# EAGLE design max-lader-1.3 (EAGLE 7.7.0)
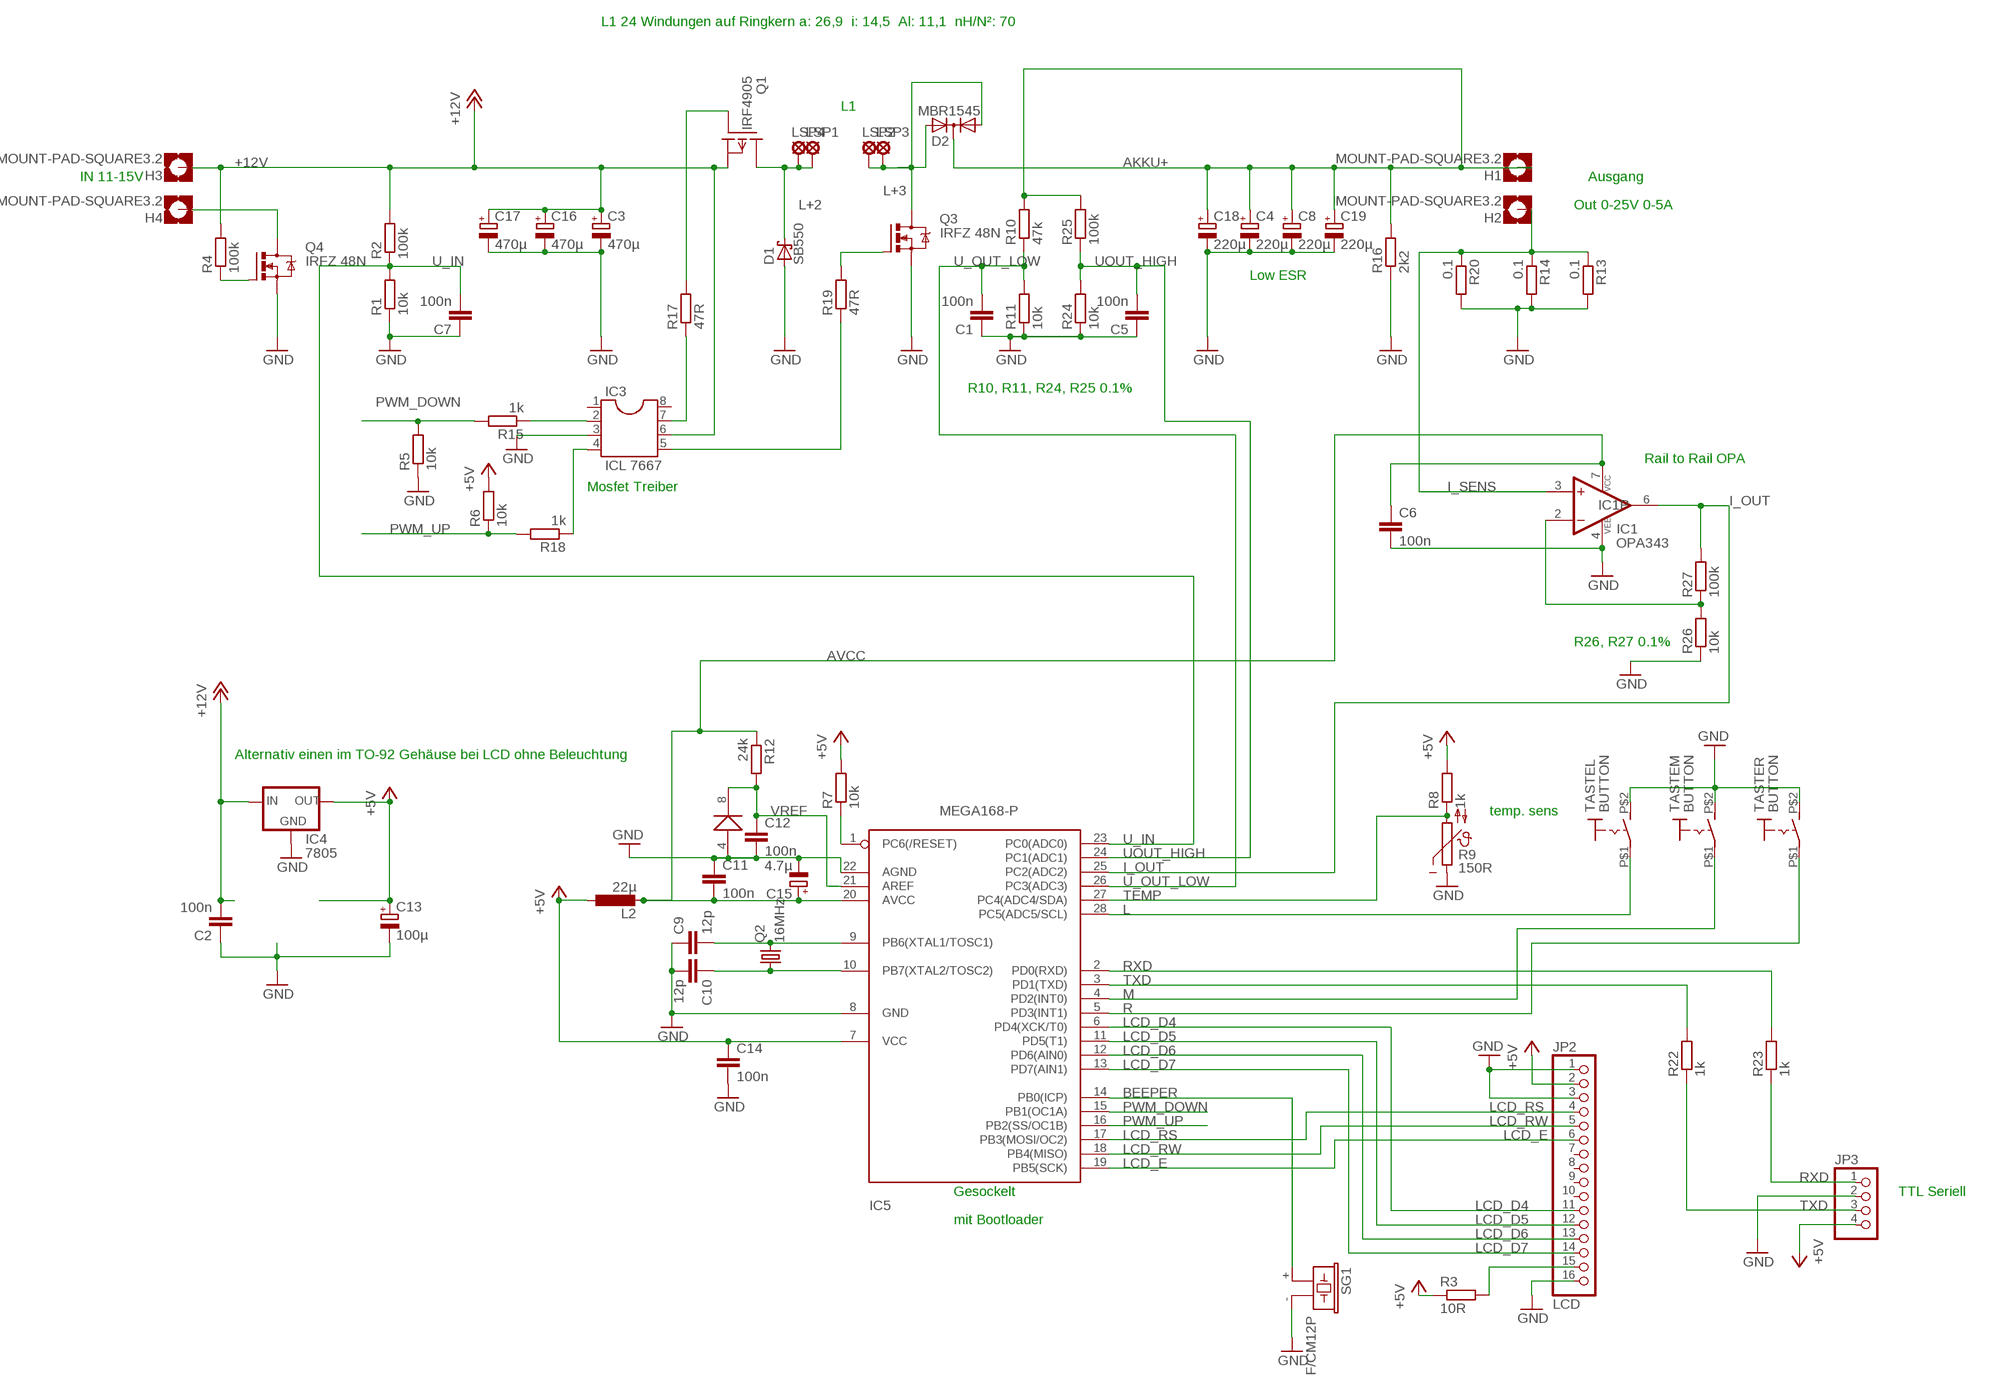
[diagram p0: schematic, sheet 1]

## Parts
C1  100n  C-EU050-024X044  [C050-024X044]
C2  100n  C-EU050-025X075  [C050-025X075]
C3  470µ  CPOL-EUE3.5-8  [E3,5-8]
C4  220µ  CPOL-EUE3.5-8  [E3,5-8]
C5  100n  C-EU050-024X044  [C050-024X044]
C6  100n  C-EU050-024X044  [C050-024X044]
C7  100n  C-EU050-025X075  [C050-025X075]
C8  220µ  CPOL-EUE3.5-8  [E3,5-8]
C9  12p  C-EU050-024X044  [C050-024X044]
C10  12p  C-EU050-024X044  [C050-024X044]
C11  100n  C-EU050-025X075  [C050-025X075]
C12  100n  C-EU050-024X044  [C050-024X044]
C13  100µ  CPOL-EUE3.5-8  [E3,5-8]
C14  100n  C-EU050-024X044  [C050-024X044]
C15  4.7µ  CPOL-EUE2-4  [E2-4]
C16  470µ  CPOL-EUE3.5-8  [E3,5-8]
C17  470µ  CPOL-EUE3.5-8  [E3,5-8]
C18  220µ  CPOL-EUE3.5-8  [E3,5-8]
C19  220µ  CPOL-EUE3.5-8  [E3,5-8]
D1  SB550  SCHOTTKY-DIODEDO201T15  [DO201T15]
D2  MBR1545  FEP16AT  [TO220ABS]
H1  MOUNT-PAD-SQUARE3.2  [3,2-PAD-SQUARE]
H2  MOUNT-PAD-SQUARE3.2  [3,2-PAD-SQUARE]
H3  MOUNT-PAD-SQUARE3.2  [3,2-PAD-SQUARE]
H4  MOUNT-PAD-SQUARE3.2  [3,2-PAD-SQUARE]
IC1  OPA343  MAX4105ESA  [SO08]
IC2  LM385-2.5  LM385  [SO08]
IC3  ICL 7667  DIL8  [DIL08]
IC4  7805  78XXL  [78XXL]
IC5  MEGA168-P  MEGA8-P  [DIL28-3]
JP2  LCD  PINHD-1X16  [1X16]
JP3  PINHD-1X4  [1X04]
L2  22µ  L-EU0207/12  [0207/12]
LSP1  SE13  [SE13]
LSP2  SE13  [SE13]
LSP3  SE13  [SE13]
LSP4  SE13  [SE13]
Q1  IRF4905  IRF9530V  [TO220V]
Q2  16MHz  CRYTALHC49S  [HC49/S]
Q3  IRFZ 48N  IRF740  [TO220BV]
Q4  IRFZ 48N  IRF740  [TO220BV]
R1  10k  R-EU_0207/10  [0207/10]
R2  100k  R-EU_0207/10  [0207/10]
R3  10R  R-EU_0207/10  [0207/10]
R4  100k  R-EU_0204/7  [0204/7]
R5  10k  R-EU_R0805  [R0805]
R6  10k  R-EU_R0805  [R0805]
R7  10k  R-EU_R0805  [R0805]
R8  1k  R-EU_R0805  [R0805]
R9  150R  NTC642-6  [P642]
R10  47k  R-EU_0207/10  [0207/10]
R11  10k  R-EU_0207/10  [0207/10]
R12  24k  R-EU_0207/10  [0207/10]
R13  0.1  R-EU_0613/15  [P0613/15]
R14  0.1  R-EU_0613/15  [P0613/15]
R15  1k  R-EU_R0805  [R0805]
R16  2k2  R-EU_0207/2V  [0207/2V]
R17  47R  R-EU_0207/10  [0207/10]
R18  1k  R-EU_R0805  [R0805]
R19  47R  R-EU_0207/10  [0207/10]
R20  0.1  R-EU_0613/15  [P0613/15]
R22  1k  R-EU_R0805  [R0805]
R23  1k  R-EU_R0805  [R0805]
R24  10k  R-EU_0207/10  [0207/10]
R25  100k  R-EU_0207/10  [0207/10]
R26  10k  R-EU_0207/10  [0207/10]
R27  100k  R-EU_0207/10  [0207/10]
SG1  F/CM12P  [F/CM12P]
TASTEL  BUTTON  [BUT]
TASTEM  BUTTON  [BUT]
TASTER  BUTTON  [BUT]

## Nets
+5V: C13.+ C14.1 IC4.OUT IC5.7(VCC) JP2.2 JP3.4 L2.1 R3.1 R6.2 R7.2 R8.2
+12V: C2.2 C3.+ C16.+ C17.+ H3.B3,2(MOUNT) IC3.6 IC4.IN Q1.3(S) R2.2 R4.2
AKKU+: C4.+ C8.+ C18.+ C19.+ D2.C H1.B3,2(MOUNT) R10.2 R16.2 R25.2
AVCC: C6.1 C11.2 C15.+ IC1.7(VCC) IC5.20(AVCC) L2.2 R12.1
BAT-: H4.B3,2(MOUNT) Q4.D
BEEPER: IC5.14(PB0(ICP)) SG1.+
BOOST_CTRL: IC3.5 R19.1
BOOST_GATE: Q3.G R19.2
BUCK_CTRL: IC3.7 R17.1
BUCK_GATE: Q1.1(G) R17.2
GND: C1.1 C2.1 C3.- C4.- C5.1 C6.2 C7.1 C8.- C9.1 C10.2 C11.1 C12.2 C13.- C14.2 C15.- C16.- C17.- C18.- C19.- D1.A IC1.4(VEE) IC2.4(ANODE) IC3.3 IC4.GND IC5.8(GND) IC5.22(AGND) JP2.1 JP2.3 JP2.16 JP3.2 Q3.S Q4.S R1.1 R5.1 R9.1 R11.1 R13.2 R14.2 R16.1 R20.2 R24.1 R26.1 SG1.- TASTEL.P$2(S) TASTEM.P$2(S) TASTER.P$2(S)
I_OUT: IC1.6(OUT) IC5.25(PC2(ADC2)) R27.2
I_SENS: H2.B3,2(MOUNT) IC1.3(+IN) R13.1 R14.1 R20.1
INPUT_GATE: Q4.G R4.1
L: IC5.28(PC5(ADC5/SCL)) TASTEL.P$1(P)
L+2: D1.C LSP1.MP LSP4.MP Q1.2(D)
L+3: D2.A1 D2.A2 LSP2.MP LSP3.MP Q3.D
LCD_D4: IC5.6(PD4(XCK/T0)) JP2.11
LCD_D5: IC5.11(PD5(T1)) JP2.12
LCD_D6: IC5.12(PD6(AIN0)) JP2.13
LCD_D7: IC5.13(PD7(AIN1)) JP2.14
LCD_E: IC5.19(PB5(SCK)) JP2.6
LCD_RS: IC5.17(PB3(MOSI/OC2)) JP2.4
LCD_RW: IC5.18(PB4(MISO)) JP2.5
M: IC5.4(PD2(INT0)) TASTEM.P$1(P)
N$1: IC3.4 R18.1
N$2: IC5.1(PC6(/RESET)) R7.1
N$3: IC3.2 R15.1
N$5: C9.2 IC5.9(PB6(XTAL1/TOSC1)) Q2.2
N$6: C10.1 IC5.10(PB7(XTAL2/TOSC2)) Q2.1
N$8: JP2.15 R3.2
N$9: IC1.2(-IN) R26.2 R27.1
PWM_DOWN: IC5.15(PB1(OC1A)) R5.2 R15.2
PWM_UP: IC5.16(PB2(SS/OC1B)) R6.1 R18.2
R: IC5.5(PD3(INT1)) TASTER.P$1(P)
RXD: IC5.2(PD0(RXD)) R23.2
RXD_OUT: JP3.1 R23.1
TEMP: IC5.27(PC4(ADC4/SDA)) R8.1 R9.2
TXD: IC5.3(PD1(TXD)) R22.2
TXD_OUT: JP3.3 R22.1
U_IN: C7.2 IC5.23(PC0(ADC0)) R1.2 R2.1
U_OUT_LOW: C1.2 IC5.26(PC3(ADC3)) R10.1 R11.2
UOUT_HIGH: C5.2 IC5.24(PC1(ADC1)) R24.2 R25.1
VREF: C12.1 IC2.8(CATODE) IC5.21(AREF) R12.2
Unconnected: IC1.1(NC) IC1.5(NC) IC1.8(NC) IC3.1 IC3.8 JP2.7 JP2.8 JP2.9 JP2.10

## Notes on the sheet
- L1 24 Windungen auf Ringkern a: 26,9  i: 14,5  Al: 11,1  nH/N²: 70
- L1
- IN 11-15V | Ausgang
- Out 0-25V 0-5A
- Low ESR
- R10, R11, R24, R25 0.1%
- Rail to Rail OPA
- Mosfet Treiber
- R26, R27 0.1%
- Alternativ einen im TO-92 Gehäuse bei LCD ohne Beleuchtung
- temp. sens
- Gesockelt | TTL Seriell
- mit Bootloader

## Library data of the parts
C1 C2 C5-C7 C9-C12 C14 = rcl:C-EU: CAPACITOR, European symbol
C3 C4 C8 C13 C15-C19 = rcl:CPOL-EU: POLARIZED CAPACITOR, European symbol
D1 = diode:SCHOTTKY-DIODE: Schottky Diode
D2 = diode:FEP16AT: DIODE dual ultra-fast recovery rectifier, common cathode
H1-H4 = holes:MOUNT-PAD-SQUARE: MOUNTING PAD, square
IC1 = maxim:MAX4105ESA: OP AMP
IC2 = linear:LM385
IC3 = ic-package:DIL8: Dual In Line
IC4 = v-reg:78XXL: VOLTAGE REGULATOR
IC5 = avr2:MEGA8-P: MICROCONTROLLER 8 Kbytes FLASH 1 kbytes SRAM 512 bytes EEPROM USART 4-channel 10 bit ADC 2-channel 8 bit ADC
JP2 = pinhead:PINHD-1X16: PIN HEADER
JP3 = pinhead:PINHD-1X4: PIN HEADER
L2 = rcl:L-EU: INDUCTOR, European symbol
LSP1-LSP4 = solpad:SE13: SOLDER PAD E1542, drill 1,3mm, distributor Buerklin, 07F815
Q1 = transistor-fet:IRF9530: P-Channel Enhancement MOSFET (HEXFET); -100V; -12A; 0,3Ohm
Q2 = crystal:CRYTAL: CRYSTAL
Q3 Q4 = transistor-power:IRF740: N-CHANNEL MOS FET
R1-R8 R10-R20 R22-R27 = rcl:R-EU_: RESISTOR, European symbol
R9 = ptc-ntc:NTC642-6: PHILIPS NTC
SG1 = buzzer:F/CM12P: BUZZER Source: Buerklin
TASTEL TASTEM TASTER = switch:BUTTON

## Board
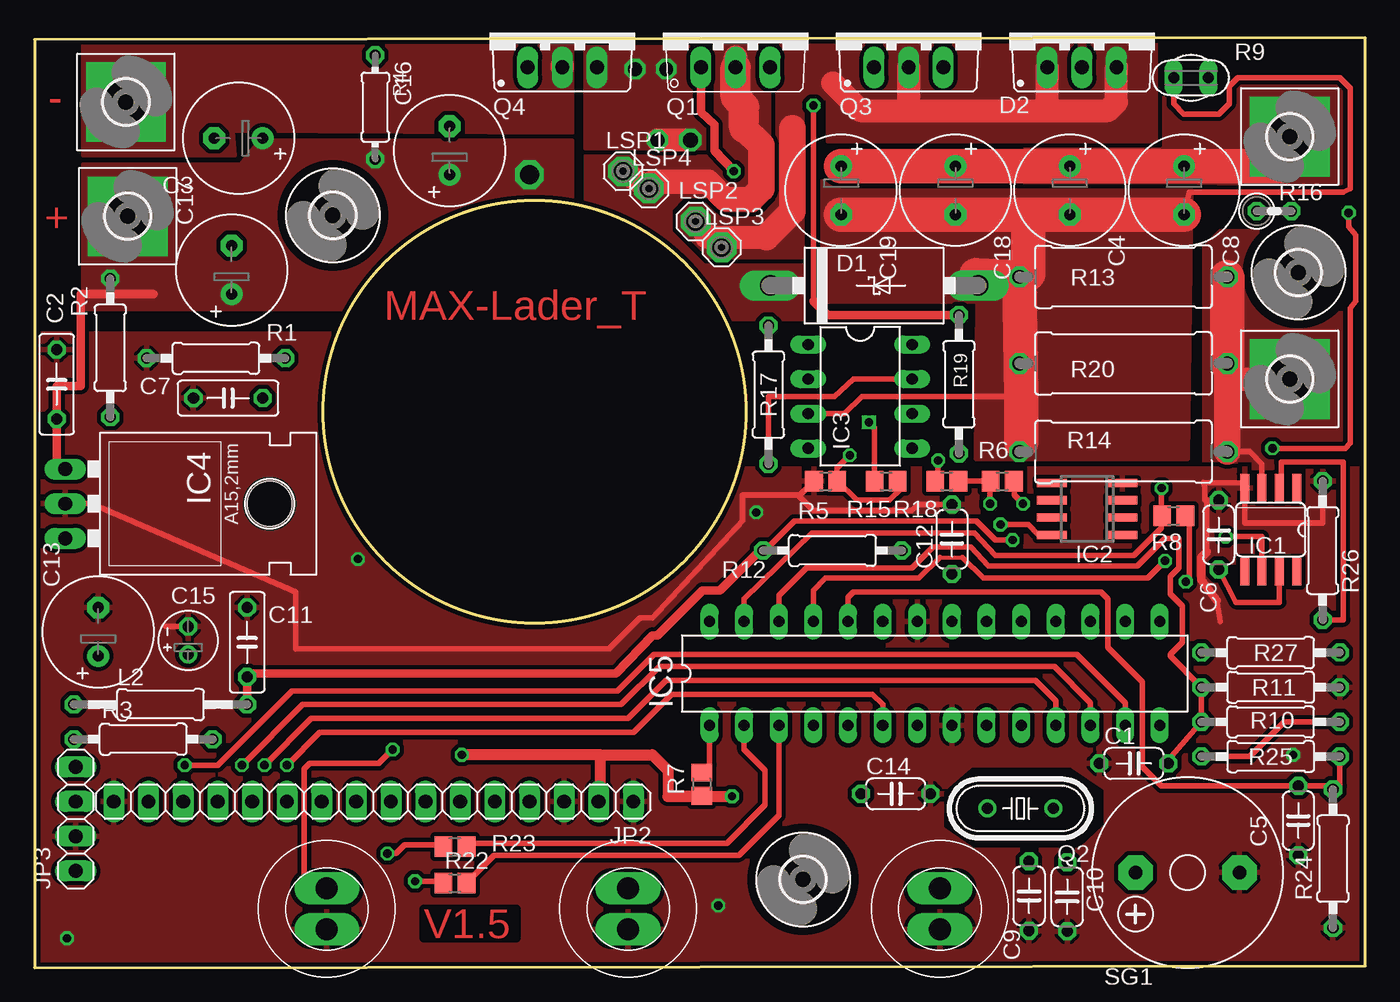
[diagram p1: board, top side]
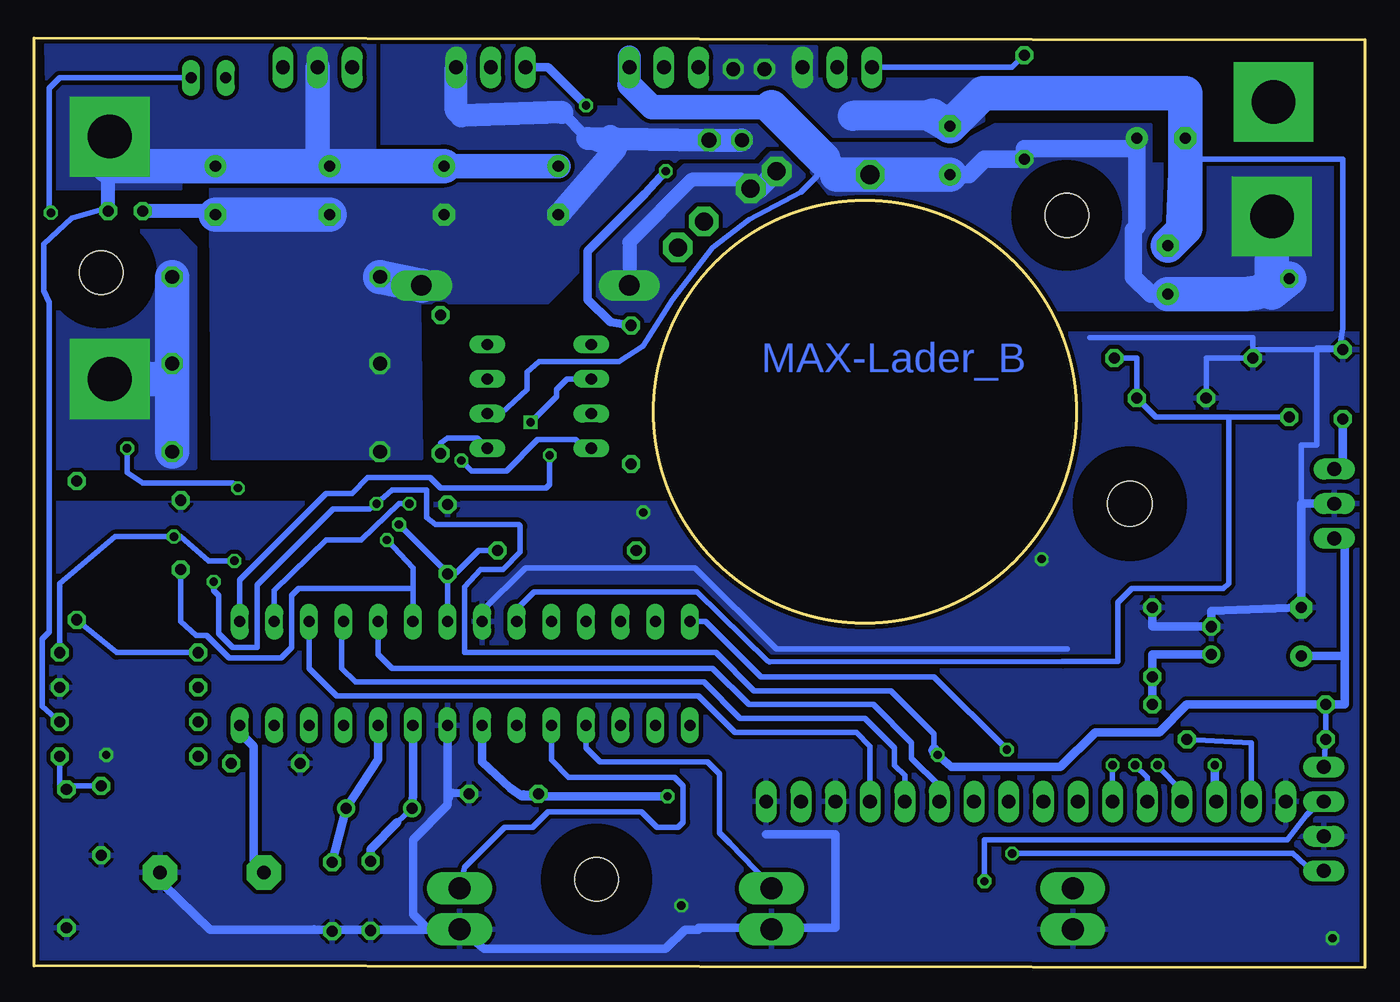
[diagram p2: board, bottom side, seen from below]

Size 97.59 x 68.19 mm. Coordinates in mm from the lower left corner, seen from the top.
Outline: 0,0 97.59,0.13 97.59,68.19 0,68.06 0,0
Outline: circle at 36.66,40.76 radius 15.5
Copper layers (1*16): Top 0.035mm / dielectric 1.5mm / Bottom 0.035mm
Design rules "default *": minimum track width 12mil, minimum drill 24mil, track to track 12mil, track to pad 12mil, pad to pad 12mil, via to via 12mil, smd to smd 8mil, copper to edge 12mil, drill to drill 12mil, minimum pad ring 10mil, minimum via ring 8mil, stop-mask expansion 4mil, vias tented up to drill 0mil, thermal gap 10mil
tRestrict: area 66.9,9 to 78.2,14.5

### Footprints (pad centres in the part's own frame; a part is rotated, then mirrored left to right if it is on the bottom)
C050-024X044 = drill 0.813 octagon: 1 -2.54,0; 2 2.54,0
C050-025X075 = drill 0.813 octagon: 1 -2.54,0; 2 2.54,0
E3,5-8 = drill 0.813 pad 1.6: + -1.778,0 | drill 0.813 pad 1.6 octagon: - 1.778,0
E2-4 = drill 0.813 pad 1.27: + -1.016,0 | drill 0.813 pad 1.27 octagon: - 1.016,0
DO201T15 = drill 1.499 long: A 7.62,0; C -7.62,0
TO220ABS = drill 1.016 long: A1 -2.54,-2.54; A2 2.54,-2.54; C 0,-2.54
3,2-PAD-SQUARE = drill 3.2 pad 5.842 square: B3,2 0,0
SO08 = smd 0.66 x 2.032: 1 -1.905,-3.073; 2 -0.635,-3.073; 3 0.635,-3.073; 4 1.905,-3.073; 5 1.905,3.073; 6 0.635,3.073; 7 -0.635,3.073; 8 -1.905,3.073
SO08' = smd 0.6 x 2.2: 1 -1.905,-2.6; 2 -0.635,-2.6; 3 0.635,-2.6; 4 1.905,-2.6; 5 1.905,2.6; 6 0.635,2.6; 7 -0.635,2.6; 8 -1.905,2.6
DIL08 = drill 0.813 long: 1 -3.81,-3.81; 2 -1.27,-3.81; 3 1.27,-3.81; 4 3.81,-3.81; 5 3.81,3.81; 6 1.27,3.81; 7 -1.27,3.81; 8 -3.81,3.81
78XXL = drill 1.016 long: GND 0,-3.81; IN -2.54,-3.81; OUT 2.54,-3.81 | hole 3.302: 0,11.176
DIL28-3 = drill 0.813 long: 1 -16.51,-3.81; 2 -13.97,-3.81; 3 -11.43,-3.81; 4 -8.89,-3.81; 5 -6.35,-3.81; 6 -3.81,-3.81; 7 -1.27,-3.81; 8 1.27,-3.81; 9 3.81,-3.81; 10 6.35,-3.81; 11 8.89,-3.81; 12 11.43,-3.81; 13 13.97,-3.81; 14 16.51,-3.81; 15 16.51,3.81; 16 13.97,3.81; 17 11.43,3.81; 18 8.89,3.81; 19 6.35,3.81; 20 3.81,3.81; 21 1.27,3.81; 22 -1.27,3.81; 23 -3.81,3.81; 24 -6.35,3.81; 25 -8.89,3.81; 26 -11.43,3.81; 27 -13.97,3.81; 28 -16.51,3.81
1X16 = drill 1.016 long: 1 -19.05,0; 2 -16.51,0; 3 -13.97,0; 4 -11.43,0; 5 -8.89,0; 6 -6.35,0; 7 -3.81,0; 8 -1.27,0; 9 1.27,0; 10 3.81,0; 11 6.35,0; 12 8.89,0; 13 11.43,0; 14 13.97,0; 15 16.51,0; 16 19.05,0
1X04 = drill 1.016 long: 1 -3.81,0; 2 -1.27,0; 3 1.27,0; 4 3.81,0
0207/12 = drill 0.813 octagon: 1 -6.35,0; 2 6.35,0
SE13 = drill 1.321 pad 2.159 octagon: MP 0,0
TO220V = drill 1.016 long: 1 -2.54,-2.54; 2 0,-2.54; 3 2.54,-2.54
HC49/S = drill 0.813: 1 -2.413,0; 2 2.413,0
TO220BV = drill 1.016 long: D 0,-2.54; G -2.54,-2.54; S 2.54,-2.54
0207/10 = drill 0.813 octagon: 1 -5.08,0; 2 5.08,0
0204/7 = drill 0.813 octagon: 1 -3.81,0; 2 3.81,0
R0805 = smd 1.3 x 1.5: 1 -0.85,0; 2 0.85,0
P642 = drill 0.813 long: 1 -1.27,0; 2 1.27,0
P0613/15 = drill 1.016 octagon: 1 -7.62,0; 2 7.62,0
0207/2V = drill 0.813 octagon: 1 -1.27,0; 2 1.27,0
F/CM12P = drill 1.016 pad 2.54 octagon: + 3.81,0; - -3.81,0
BUT = drill 1.6 long: P$1 0,1.5; P$2 0,-1.5
3,2 = hole 3.2: 0,0

### Placement (x,y rotation side)
C1  80.61,14.98 0 top
C2  1.61,42.79 270 top
C3  14.95,60.83 180 top
C4  75.91,57.02 270 top
C5  92.67,10.79 90 top
C6  86.83,31.74 90 top
C7  14.19,41.78 0 top
C8  84.29,57.02 270 top
C9  72.92,5.27 90 top
C10  75.72,5.2 270 top
C11  15.58,23.87 270 top
C12  67.27,31.43 90 top
C13  4.66,24.63 90 top
C14  63.14,12.76 0 top
C15  11.27,24 90 top
C16  30.44,59.94 90 top
C17  14.44,51.18 90 top
C18  67.53,57.02 270 top
C19  59.14,57.02 270 top
D1  61.56,50.03 0 top
D2  76.8,68.58 0 top
H1  92.04,60.95 0 top
H2  92.04,43.17 0 top
H3  6.82,55.11 0 top
H4  6.69,63.5 0 top
IC1  90.64,32.13 180 top
IC2  LM385-2.5  [SO08']  77.18,33.65 90 top
IC3  60.54,41.91 270 top
IC4  6.06,34.03 270 top
IC5  66,21.59 0 top
JP2  24.85,12.19 180 top
JP3  3.01,10.92 90 top
L2  9.23,19.3 0 top
LSP1  43.14,58.41 0 top
LSP2  48.48,54.73 0 top
LSP3  50.38,52.83 0 top
LSP4  45.05,57.14 0 top
Q1  51.4,68.58 0 top
Q2  72.29,11.68 180 top
Q3  64.1,68.58 0 top
Q4  38.7,68.58 0 top
R1  13.3,44.7 0 top
R2  5.55,45.46 90 top
R3  7.96,16.76 0 top
R4  24.98,63.11 270 top
R5  58,35.68 0 top
R6  70.95,35.68 0 top
R7  48.92,13.46 270 top
R8  83.53,33.14 0 top
R9  84.8,65.27 0 top
R10  90.64,18.03 0 top
R11  90.64,20.57 180 top
R12  58.51,30.6 0 top
R13  79.84,50.67 180 top
R14  79.84,37.84 180 top
R15  62.45,35.68 0 top
R16  90.89,55.49 0 top
R17  53.81,42.03 90 top
R18  66.89,35.68 0 top
R19  67.78,42.79 90 top
R20  79.84,44.32 180 top
R22  30.82,6.22 0 top
R23  30.82,8.88 0 top
R24  95.21,8 90 top
R25  90.64,15.49 180 top
R26  94.45,30.6 270 top
R27  90.64,23.11 0 top
SG1  84.54,6.98 180 top
TASTEL  21.42,4.31 0 top
TASTEM  43.52,4.31 0 top
TASTER  66.38,4.31 0 top
U$2  [3,2]  21.87,55.18 0 top
U$3  [3,2]  92.67,50.99 0 top
U$4  [3,2]  56.35,6.47 0 top

### Tracks (layer width: path | path; a pad name or v marks a point on that pad's centre or on a via)
+5V  (via drill 0.6, 0.61)
  Top 0.406: R6.2 71.72,35.59 71.84,35.43 71.84,34.67 v72.48,34.03 | v84.42,28.32 84.67,28.7 84.67,32.89 84.38,33.18 R8.2
  Top 0.813: JP2.2 41.49,12.31 41.49,15.62 | 41.49,15.62 45.3,15.62 46.44,14.47 46.44,12.57 47.46,12.57 | 47.46,12.57 v51.14,12.57 | 41.49,15.62 v31.33,15.62 | 47.46,12.57 47.5,12.61 R7.2
  Bottom 0.406: C14.1 61.68,12.82 61.81,12.57 | v31.33,15.62 31.71,16 | 31.58,16 31.58,17.14 34.76,20.31 44.79,20.31 47.59,23.11 66,23.11 66,27.94 64.86,29.2 63.21,29.2 61.94,30.48 61.94,32.38 62.06,32.51 68.16,32.51 68.8,33.02 68.8,35.05 71.34,35.05 v72.48,34.03 72.99,33.65 75.65,33.65 81.24,28.06 81.24,23.49 83.02,23.49 84.04,24.51 84.04,27.3 84.42,27.68 v84.42,28.32 | L2.1 1.49,19.3 | L2.1 R3.1 JP3.4 | L2.1 2.88,19.43
  Bottom 0.61: IC5.7 64.73,15.11 62.7,13.2 61.81,12.57 v51.14,12.57 | v31.33,15.62 30.32,14.73 22.31,14.73 19.77,17.27 15.08,17.27 13.04,19.3 1.49,19.3 1.49,22.85 | 1.49,22.85 1.49,31.49 IC4.OUT | 1.49,22.85 C13.+
  Bottom 0.813: v31.33,15.62 31.58,15.87 31.58,16
+12V  (via drill 1.4)
  Top 0.406: IC4.IN 1.61,36.57
  Top 0.61: 8.72,49.4 3.39,49.4 3.39,42.67 1.61,42.67 1.61,36.57
  Bottom 0.406: 40.22,59.68 39.71,59.3 40.22,58.03 41.36,56.89 45.17,54.86 47.84,52.83 50.76,49.02 52.92,45.59 54.7,44.45 60.54,44.45 61.43,43.68 61.43,42.41 63.34,40.63 IC3.6 | IC4.IN 1.61,36.57
  Bottom 0.61: 1.61,36.57 C2.2
  Bottom 1.016: 7.96,49.52 7.96,49.65
  Bottom 1.27: C16.+ 29.04,58.16 27.9,59.3 R4.2 24.98,60.07 16.73,60.07 C3.+ 16.73,54.35 16.98,54.1 16.98,50.67 15.71,49.4 14.31,49.4
  Bottom 1.676: 53.94,64.77 Q1.3 53.94,66.8 | 38.7,58.16 39.71,59.3
  Bottom 1.778: 53.94,64.77 52.29,63.11 43.52,63.11
  Bottom 2.54: 39.71,59.3 43.52,63.11 | C16.+ v36.28,58.16 38.7,58.16 | 6.69,55.11 H3.B3,2 6.82,49.52 R2.2 7.96,49.52 8.72,49.4 14.31,49.4 C17.+
  pour Top (no thermals): 3.52,58.92 15.08,58.92 16.47,60.7 39.46,60.7 39.46,56.26 34,56.26 28.79,54.48 24.98,51.18 22.95,48.25 3.52,48.25
  pour Bottom (rank 2, no thermals): 2.37,48.25 23.08,48.25 24.35,50.54 27.52,53.84 32.22,55.75 39.33,56.76 42.25,60.45 29.68,60.45 27.14,61.84 15.71,61.84 15.71,58.92 2.37,58.92
AKKU+
  Top 0.406: R10.2 91.66,18.03 89.12,15.49 R25.2
  Top 2.54: C19.+ 91.4,58.8 92.16,60.19
  Bottom 0.406: 92.16,55.75 94.83,54.99 96.86,53.08 96.86,49.65 96.48,48.76 96.48,24.63 96.99,24.12 96.99,19.17 R10.2
  Bottom 1.016: 91.28,60.19 H1.B3,2 92.16,58.8 92.16,55.75 R16.2 | C4.+ 76.8,60.19
  Bottom 1.778: 76.8,60.19 D2.C | C18.+ C19.+
  Bottom 2.54: C18.+ C4.+ C8.+ 92.16,58.8 91.28,60.19
  pour Bottom (no thermals): 72.61,57.65 72.61,67.69 96.74,67.69 96.48,57.14 86.83,57.14 86.83,57.65
  pour Top (rank 3, no thermals): 72.61,57.53 72.61,67.69 96.74,67.69 96.48,57.14 86.83,57.14 86.83,57.53
AVCC  (via drill 0.6)
  Top 0.406: 53.56,30.6 55.72,32.76 69.05,32.76 70.45,31.36 v71.72,31.36 | IC1.7 91.28,26.79 88.1,26.79 C6.1 | 53.18,30.6 R12.1
  Top 0.61: L2.2 15.58,21.59 42.63,21.59 45.3,24.38 45.68,24.38 48.98,27.68 50.25,27.68 53.18,30.6 53.56,30.6
  Bottom 0.305: 69.81,27.11 69.87,27.8 69.88,27.94
  Bottom 0.406: IC5.20 69.81,27.11 69.81,29.33 v71.72,31.36 | 69.87,27.8 69.82,27.8 69.81,27.81 78.19,27.81 78.7,27.3 78.7,23.49 79.46,22.73 83.27,22.73 84.92,24.38 85.69,24.38 86.83,25.4 C6.1
  Bottom 0.61: C15.+ 15.58,22.98 C11.2 L2.2
BAT-
  Top 1.676: Q4.D 38.7,66.16
  pour Top (no thermals): 3.52,67.81 3.52,59.56 14.69,59.56 14.57,61.34 39.46,61.21 39.46,67.69
BEEPER
  Bottom 0.406: IC5.14 82.39,17.77
  Bottom 0.61: IC5.14 82.51,17.27 81.5,16.25 81.5,7.87 SG1.+
BOOST_CTRL
  Bottom 0.406: IC3.5 65.11,38.86 67.27,38.86 67.78,38.48 R19.1
BOOST_GATE  (via drill 0.6)
  Top 0.406: 57.11,48.89 v57.11,63.24
  Top 0.61: 57.11,48.89 58.13,47.87 R19.2
  Bottom 0.61: Q3.G 59.91,66.03 v57.11,63.24
BUCK_CTRL
  Top 0.406: R17.1 53.81,41.91 58.64,41.91 60.03,43.17 IC3.7
BUCK_GATE  (via drill 0.61)
  Top 0.61: v51.27,58.41 49.87,59.94 49.87,61.84 48.86,62.73 Q1.1
  Bottom 0.61: v51.27,58.41 52.79,56.76 56.98,52.57 56.98,49.02 55.33,47.37 R17.2
GND  (via drill 0.6, 1.02, 1.1)
  Top 0.406: 86.7,26.92 86.96,25.4 | C8.- 84.67,56.89 95.97,56.89 96.48,57.14 96.48,64.51 95.72,65.27 88.23,65.27 87.59,64.64 87.59,63.37 86.83,62.61 84.29,62.61 83.53,63.37 R9.1 83.66,65.4 | R26.1 94.45,32.63 88.73,32.63 IC1.4 88.73,35.55 85.69,35.58 85.81,35.3 85.81,34.28 85.94,34.28 | 85.94,30.48 85.94,34.28 | 67.27,33.9 C12.2 64.8,33.97 64.35,33.52 57.11,33.52 55.97,34.67 | 85.94,34.28 C6.2 | 80.73,35.55 IC2.4 | TASTEL.P$2 21.42,2.79 | IC3.3 59.4,40.63 60.67,41.91 72.35,41.91 | IC4.GND 4.15,34.03 19.14,27.55 19.14,23.36 42.13,23.36 44.41,25.65 45.3,25.65 51.91,32.76 51.91,34.67 55.97,34.67 | 9.61,25.01 C15.- | TASTEL.P$2 21.42,2.92 | 21.3,2.79 TASTEL.P$2 | 55.97,34.67 56.14,34.67 R5.1
  Top 0.61: 85.94,30.48 85.56,30.09 85.56,28.44 86.7,26.92
  Top 1.676: 72.86,50.92 72.99,50.92 R13.2 | v48.09,60.7 v45.68,60.7
  Top 2.54: C19.- C18.- 72.86,55.24 | 72.86,55.24 C8.- | 72.86,50.92 72.86,55.24 | 69.05,50.8 R13.2 72.35,41.91 72.35,38.6
  Bottom 0.406: 67.27,11.93 67.02,12.7 66.89,12.82 | 48.86,2.92 TASTEM.P$2 48.86,2.79 | TASTER.P$2 66.64,2.81 66.64,2.92 68.8,2.92 | 68.82,2.81 68.8,2.81 68.8,2.79 | IC5.22 64.73,26.16 61.56,29.33 49.11,29.33 43.14,23.36 21.81,23.36 | 73.24,2.66 73.24,2.79 73.24,2.98 C9.1 | C10.2 77.05,2.92 77.05,2.79 | C17.- 14.19,59.3 1.61,59.3 1.61,46.86 1.87,45.33 | C2.1 1.87,45.33 | C2.1 1.49,45.33 | C7.1 11.65,44.7 R1.1 | C11.1 16.09,26.41 | 1.61,45.46 1.49,45.46 | 1.61,45.46 C2.1 | 1.61,45.46 3.52,45.46 3.52,38.35 4.66,38.35 4.66,33.65 | R1.1 8.22,44.57 | 1.87,45.33 8.22,45.33 R1.1 | 20.15,46.22 8.22,46.22 R1.1
  Bottom 0.61: 43.9,9.77 38.82,9.77 38.82,2.92 48.86,2.92 | 89.24,7.23 84.67,2.79 77.05,2.79 73.24,2.79 68.8,2.79 | TASTER.P$2 64.58,1.39 51.27,1.39 49.87,2.79 48.86,2.79 | 66.89,12.82 C14.2 | 66.64,2.81 68.8,2.81 | IC5.8 67.27,11.93 69.81,9.39 69.81,3.93 68.8,2.92 | IC4.GND 4.66,34.03 4.66,33.65 C13.- 11.27,26.16 C15.- 15.58,25.01 C11.1 15.96,26.54
  Bottom 0.813: 56.98,60.83 58.89,62.73
  Bottom 1.016: C8.- 84.16,55.49 R16.1
  Bottom 1.422: 54.95,60.07 56.98,60.83
  Bottom 1.676: Q3.S 66.64,62.86 66.26,62.48 58.89,62.73 | v45.68,60.7 v48.09,60.7 56.98,60.83 | 55.33,60.95 54.95,60.07 C19.-
  Bottom 2.184: 31.71,62.48 37.55,62.48
  Bottom 2.54: C8.- C4.- | R13.2 D1.A | 31.71,62.48 C16.- 28.03,64.13 13.17,64.13 C3.- 13.17,54.22 C17.-
  other vias: 46.32,65.91 44.03,65.91 92.29,15.62 52.92,33.4 23.71,29.97 2.37,2.15 50.13,4.57
  pour Bottom (isolate 0.1, rank 6, no thermals): 69.18,37.33 84.54,37.33 84.67,62.1 72.35,62.1 72.35,67.81 60.41,67.81 60.41,67.43 57.24,63.11 54.7,63.11 54.7,67.69 40.22,67.56 40.22,65.15 28.03,65.15 27.9,59.05 49.87,58.92 59.91,48.76 69.3,48.76
  pour Top: -0.04,46.48 38.44,46.48 50.25,36.57 98.01,36.57 97.37,0.5 -0.04,0.5
  pour Top (no thermals): 57.75,57.91 57.75,48.89 69.18,48.89 69.05,37.33 84.54,37.33 84.8,57.02
  pour Bottom: -0.17,46.48 37.43,46.48 51.14,34.03 97.37,34.03 97.37,0.38 0.09,0.38
  pour Top (no thermals): 40.35,67.56 40.35,60.07 49.49,60.07 49.49,67.56
I_OUT  (via drill 0.61)
  Top 0.305: 66.38,30.09 68.03,30.09
  Top 0.406: 66.38,30.09 64.86,28.57 58,28.57 57.11,27.68 IC5.25 | 68.03,30.09 69.56,28.57 81.62,28.57 v82.89,29.84 | v87.34,31.62 90,31.62 IC1.6
  Bottom 0.406: v82.89,29.84 84.8,29.84 86.83,31.62 | 86.83,31.62 v87.34,31.62 91.66,31.62 95.72,28.19 R27.2 | 86.83,31.62 86.96,31.49
I_SENS
  Top 0.406: R14.1 89.12,37.84 90,36.95 IC1.3
  Top 1.676: R20.1 87.47,43.17 H2.B3,2
  Top 1.93: R14.1 R20.1
  Top 2.54: R20.1 R13.1
  Bottom 0.406: H2.B3,2 92.29,42.92
  Bottom 1.422: R20.1 R13.1
  Bottom 1.778: R20.1 87.59,44.45
  Bottom 2.54: R20.1 87.47,43.17 H2.B3,2 | R20.1 R13.1 | R14.1 R20.1
  pour Bottom (rank 2, no thermals): 85.81,36.7 85.81,52.83 86.96,53.97 94.96,53.97 96.36,52.57 96.36,36.7
  pour Top (rank 2, no thermals): 85.81,36.7 85.81,52.83 86.96,53.97 94.96,53.97 96.36,52.57 96.36,36.7
INPUT_GATE
  Bottom 0.406: R4.1 25.87,66.03 Q4.G
L  (via drill 0.6)
  Top 0.406: v26.25,16 25.23,14.98 20.15,14.98 19.77,14.6 19.77,6.09 20.05,5.81 TASTEL.P$1
  Bottom 0.406: IC5.28 48.35,25.4 44.29,21.33 31.58,21.33 v26.25,16
L+2
  Top 1.422: LSP4.MP 45.43,57.65
  Top 1.676: LSP4.MP LSP1.MP | Q1.2 51.4,66.8
  Top 1.778: 45.43,57.65 49.37,57.65 50.64,56.38 52.54,56.38
  Top 1.93: 52.54,56.38 53.3,57.14 53.3,60.32 52.03,61.59
  Top 2.184: Q1.2 51.4,63.88 52.03,63.11 52.03,61.59
  Bottom 1.016: D1.C 53.94,53.21 49.37,57.78 45.68,57.78 LSP4.MP 44.41,57.14
  Bottom 1.422: 44.41,57.14 LSP1.MP
  pour Top (rank 4, no thermals): 40.48,59.56 49.49,59.68 50,60.19 50,67.56 53.94,67.56 53.94,59.56 56.35,59.56 56.35,47.62 40.48,47.62
  pour Bottom (no thermals): 40.48,47.87 40.48,57.4 41.75,58.67 42.76,59.68 43.52,59.68 44.41,58.8 49.87,58.8 56.48,52.19 56.48,47.49 40.86,47.49
L+3
  Top 1.422: 49.24,53.59 LSP2.MP LSP3.MP
  Top 1.676: D2.A2 79.34,63.5 78.7,62.86 74.26,62.86 | 74.26,62.86 D2.A1 | 64.1,62.86 74.26,62.86 | 64.1,62.86 Q3.D | 49.24,53.59 53.68,53.59 | 58.51,64.89 60.54,62.86 64.1,62.86
  Top 1.93: 53.68,53.59 55.59,55.49 55.59,61.59
  pour Top (no thermals): 49.49,52.06 56.35,52.06 56.35,63.75 58.13,63.75 58.13,60.57 82.26,60.57 82.26,68.07 54.45,68.07 54.45,56.26 53.18,54.99 50.25,54.99 49.24,56 47.97,56 47.21,55.24 47.21,54.35
LCD_D4  (via drill 0.6)
  Top 0.406: v18.5,14.85 20.92,17.27 43.9,17.27 46.7,20.06 61.43,20.06 62.19,19.3 IC5.6 62.19,17.65
  Bottom 0.406: JP2.11 v18.5,14.85
LCD_D5  (via drill 0.6)
  Top 0.406: IC5.11 74.89,19.55 73.37,21.08 46.32,21.08 43.52,18.28 20.28,18.28 v16.85,14.85
  Bottom 0.406: JP2.12 15.96,13.97 v16.85,14.85
LCD_D6  (via drill 0.6)
  Top 0.406: v15.2,14.85 19.65,19.3 43.02,19.3 45.81,22.09 74.77,22.09 77.43,19.43 IC5.12 77.43,17.65
  Bottom 0.406: JP2.13 13.42,12.95 v15.2,14.85
LCD_D7  (via drill 0.6)
  Top 0.406: IC5.13 79.97,19.43 76.42,22.98 45.43,22.98 42.76,20.31 18.88,20.31 13.42,14.85 v11.01,14.85
  Bottom 0.406: 11.01,12.44 11.01,12.19 JP2.14
  Bottom 0.61: 11.01,12.44 v11.01,14.85
LCD_E
  Bottom 0.406: IC5.19 72.35,22.98 71.34,21.97 47.84,21.97 45.17,19.3 36.03,19.3 33.24,16.51 33.24,15.36 31.2,13.33 JP2.6 31.08,12.19
LCD_RS
  Bottom 0.406: IC5.17 77.43,21.97 75.4,19.93 48.86,19.93 46.19,17.27 37.3,17.27 36.28,16.25 JP2.4 36.28,12.06
LCD_RW
  Bottom 0.406: IC5.18 75.02,25.27 75.02,21.97 74,20.95 48.48,20.95 45.81,18.28 36.66,18.28 34.51,16.12 34.51,14.85 33.74,14.09 JP2.5 33.87,12.19
M
  Bottom 0.406: TASTEM.P$1 43.63,5.84 43.78,6.22 46.57,9.14 47.33,9.9 47.33,14.22 48.22,15.11 56.1,15.11 57.11,16.12 IC5.4
N$1  (via drill 0.6)
  Top 0.406: v66.26,37.21 66.26,35.9 R18.1
  Bottom 0.406: 66.13,37.08 v66.26,37.21 65.49,36.44 62.95,36.44 60.67,38.73 57.87,38.73 57.24,38.09 IC3.4
N$2
  Top 0.406: R7.1 49.49,14.88 IC5.1
N$3  (via drill 0.6)
  Top 0.406: R15.1 61.6,39.58 v61.18,40
  Bottom 0.406: v61.18,40 59.27,41.91 59.27,42.41 58.51,43.17 IC3.2
N$5
  Bottom 0.406: 70.95,10.66 Q2.2
  Bottom 0.61: Q2.2 69.81,12.76 IC5.9 | C9.2 72.92,8.69 70.95,10.66
N$6
  Bottom 0.61: IC5.10 72.35,15.3 Q2.1 C10.1
N$8
  Bottom 0.406: JP2.15 8.34,16.51 R3.2
N$9
  Top 0.406: IC1.2 91.4,35.96 91.4,37.08 95.97,37.08 95.97,25.52 R26.2
  Bottom 0.406: R27.1 91.53,23.11 R26.2
PWM_DOWN  (via drill 0.6)
  Top 0.406: R15.2 63.59,35.39 63.59,35.17 62.7,34.28 60.29,34.28 58.89,35.68 R5.2 58.85,36.66 v59.78,37.59
  Bottom 0.406: IC5.15 82.51,28.44 76.16,34.79 74.26,34.79 73.11,35.94 68.54,35.94 67.78,35.17 60.03,35.17 59.78,35.43 v59.78,37.59
PWM_UP  (via drill 0.6)
  Top 0.406: R18.2 R6.1 70.07,35.17 v70.07,34.03
  Bottom 0.406: IC5.16 79.97,27.68 76.16,31.36 73.62,31.36 70.83,34.03 v70.07,34.03
R
  Bottom 0.406: TASTER.P$1 66,7.36 63.08,10.28 61.05,10.28 59.91,11.43 53.05,11.43 51.91,10.28 50.38,10.28 50,10.66 50,13.33 50.64,13.97 58.38,13.97 59.65,15.24 IC5.5 59.65,17.9
RXD
  Top 0.406: IC5.2 52.03,16 53.56,14.47 53.56,11.93 50.76,9.14 31.97,9.14 31.46,9.01 31.46,8.5 31.67,8.72 R23.2
RXD_OUT  (via drill 0.6)
  Top 0.406: R23.1 29.85,9.01 27.14,9.01 26.5,8.38 v25.87,8.38
  Bottom 0.406: v25.87,8.38 5.3,8.38 3.9,7.11 JP3.1
TEMP  (via drill 0.6, 0.61)
  Top 0.406: v96.36,55.37 96.36,54.35 96.86,53.72 96.86,48.89 96.48,48.38 96.48,38.48 96.1,38.09 v90.77,38.09 | IC5.27 52.03,27.05 56.98,31.87 68.92,31.87 70.45,30.22 80.61,30.22 82.64,32.25 82.64,33.1 R8.1 82.64,33.18 v82.64,35.17
  Bottom 0.406: R9.2 95.72,65.27 96.48,64.51 96.48,55.49 v96.36,55.37 | v90.77,38.09 90.77,36.32 89.62,35.55 83.02,35.55 v82.64,35.17
TXD
  Top 0.406: IC5.3 54.57,11.17 51.65,8.25 33.71,8.25 R22.2
TXD_OUT  (via drill 0.6)
  Top 0.406: R22.1 29.85,6.35 v27.9,6.35
  Bottom 0.406: JP3.3 3.26,12.19 4.28,11.17 5.68,9.39 27.9,9.39 v27.9,6.35
U_IN
  Bottom 0.406: 22.19,22.47 22.06,22.47 | 22.19,22.47 43.65,22.41 43.84,22.54 48.98,27.55 60.92,27.55 62.19,26.28 IC5.23 | 10,40.38 R2.1 | 10,40.38 15.33,40.38 C7.2 16.73,44.7 R1.2 | 22.19,22.47 | 22.19,22.47 18.12,22.47 18.12,26.79 17.11,27.81 10.38,27.81 10,28.19 10,40.38
U_OUT_LOW
  Top 0.406: IC5.26 54.57,27.3 56.6,29.33 64.35,29.33 65.88,30.86 68.67,30.86 69.94,29.46 80.86,29.46 82.89,31.49 83.91,31.49 83.91,29.33 83.27,28.7 83.27,27.43 84.16,26.54 84.16,23.87 83.27,22.98 83.27,22.85 R11.2 85.56,18.16 85.43,18.03 R10.1 83.15,15.24 C1.2
UOUT_HIGH
  Top 0.406: IC5.24 59.65,27.17 60.03,27.55 78.19,27.55 78.7,27.05 78.7,23.49 81.24,20.95 81.24,14.73 82.64,13.33 95.72,13.33 R25.1
  Bottom 0.406: 95.21,13.33 R24.2 | R25.1 95.72,13.33 95.21,13.33 | 95.21,13.33 C5.2
VREF  (via drill 0.61)
  Top 0.406: IC2.8 73.62,31.74 72.86,32.51 v70.83,32.51
  Bottom 0.406: IC5.21 C12.1 67.27,28.95 | 67.27,28.95 v70.83,32.51 | R12.2 64.99,30.6 66.64,28.95 67.27,28.95

### Text on the board
Top: - | + | MAX-Lader_T | V1.5
Bottom: MAX-Lader_B
tValues: L1 24W 1,2mm CU | auf T106 Ringkern